# Altium schematic sheet PCM2706_CODEC_MAIN.SchDoc
size A4
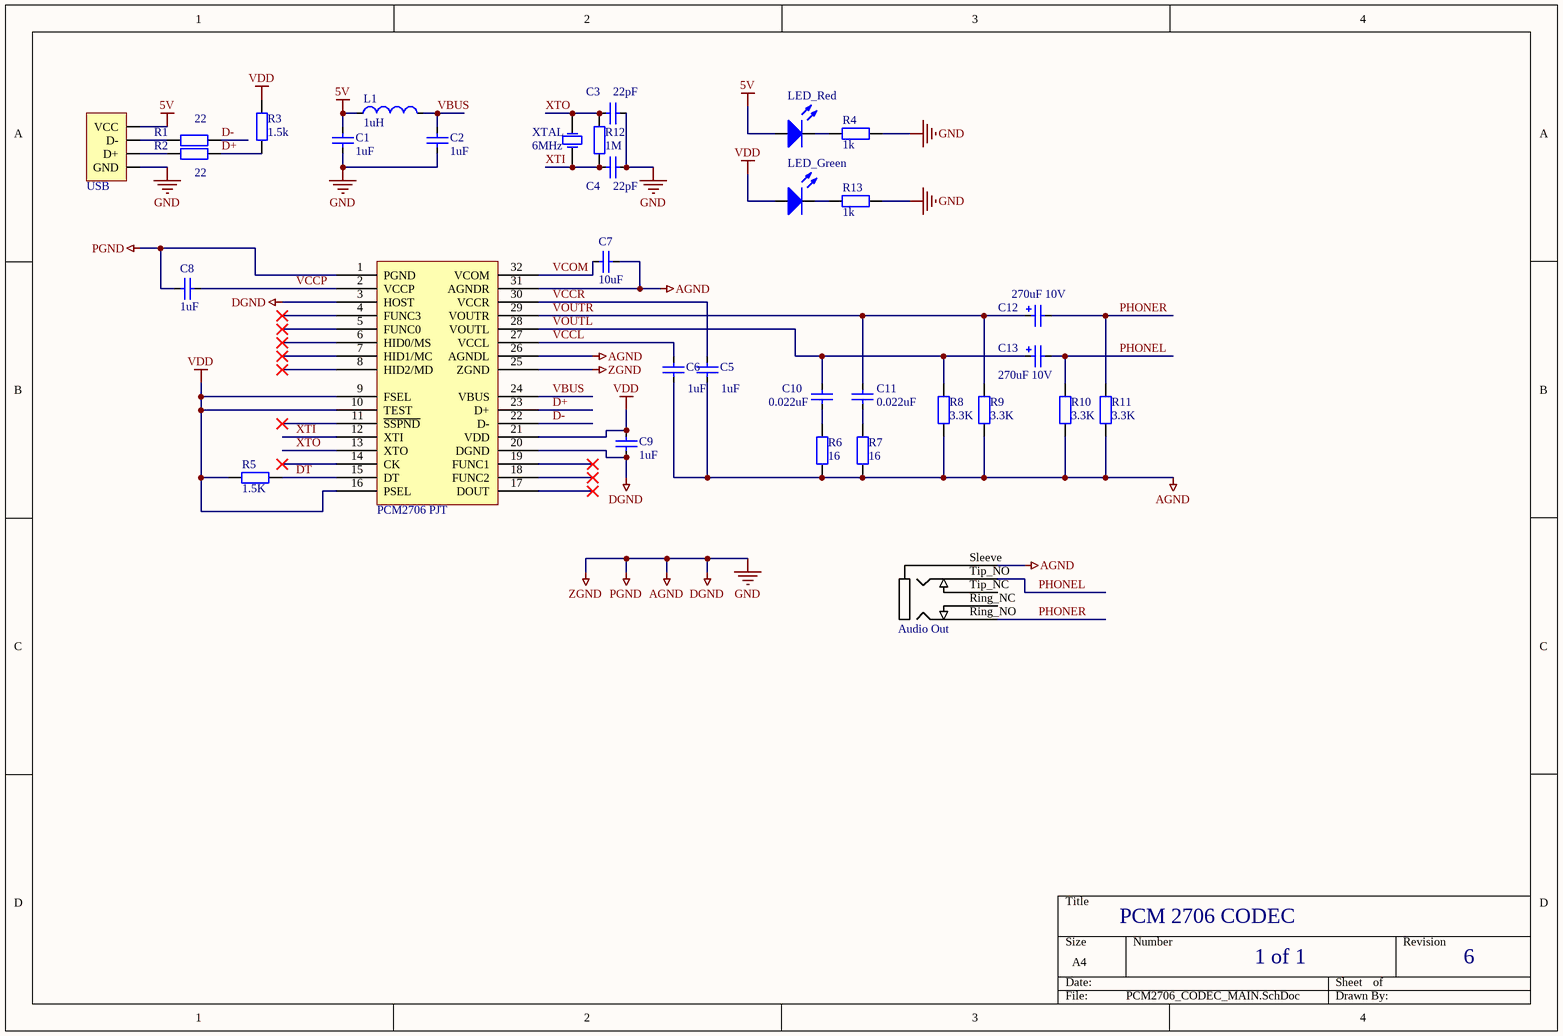
[diagram p0: PCM2706_CODEC_MAIN.SchDoc]

## Parts
Audio_Out  Generic 3.5 PhoneJack 5 Pin through-hole  [3.5 PhoneJack 5 Pin]  (value not drawn)
C1  value 1uF  [CAP_0603]  (hidden comment: Cap_0603)
C2  value 1uF  [CAP_0603]  (hidden comment: Cap_0603)
C3  value 22pF  [CAP_0603]  (hidden comment: Cap_0603)
C4  value 22pF  [CAP_0603]  (hidden comment: Cap_0603)
C5  1uF  [CAP_0603]
C6  1uF  [CAP_0603]
C7  10uF  [CAP_0603]
C8  1uF  [CAP_0603]
C9  1uF  [CAP_0603]
C10  0.022uF  [CAP_0603]
C11  0.022uF  [CAP_0603]
C12  value 270uF 10V  [CAP_ELEC_F3.5_D8_H11.5]  (hidden comment: 270uF)
C13  value 270uF 10V  [CAP_ELEC_F3.5_D8_H11.5]  (hidden comment: 270uF)
L1  value 1uH  [IND_0603]  (hidden comment: Ind_0603)
LED_Green  LED_0603_RED  [LED_0603_RED]  (value not drawn)
LED_Red  LED_0603_RED  [LED_0603_RED]  (value not drawn)
PCM2706_PJT  PCM2706 PJT  [TI-S-PQFP-N32]  (value not drawn)
R1  value 22  [RES_0603]  (hidden comment: Res_0603)
R2  value 22  [RES_0603]  (hidden comment: Res_0603)
R3  value 1.5k  [RES_0603]  (hidden comment: Res_0603)
R4  1k  [RES_0603]
R5  1.5K  [RES_0603]
R6  16  [RES_0603]
R7  16  [RES_0603]
R8  3.3K  [RES_0603]
R9  3.3K  [RES_0603]
R10  3.3K  [RES_0603]
R11  3.3K  [RES_0603]
R12  value 1M  [RES_0603]  (hidden comment: Res_0603)
R13  1k  [RES_0603]
USB  USB  [USB]  (value not drawn)
XTAL  value 6MHz  [XTAL_5032]  (hidden comment: XTAL_5032)

## Nets
5V: C1.2 L1.1 LED_Red.1(A) USB.1(VCC)
AGND: Audio_Out.Sleeve C1.1 C2.1 C3.1 C4.1 C5.1 C6.1 C7.1 C8.2 C9.1 PCM2706_PJT.1(PGND) PCM2706_PJT.3(HOST) PCM2706_PJT.20(DGND) PCM2706_PJT.25(ZGND) PCM2706_PJT.26(AGNDL) PCM2706_PJT.31(AGNDR) R4.2 R6.2 R7.2 R8.2 R9.2 R10.2 R11.2 R13.2 USB.4(GND)  [also labelled DGND, GND, PGND, ZGND]
VDD: C9.2 LED_Green.1(A) PCM2706_PJT.9(FSEL) PCM2706_PJT.10(TEST) PCM2706_PJT.16(PSEL) PCM2706_PJT.21(VDD) R3.1 R5.1
D+: PCM2706_PJT.23(D+) R2.2 R3.2
D-: PCM2706_PJT.22(D-) R1.2
DT: PCM2706_PJT.15(DT) R5.2
PHONEL: Audio_Out.Tip_NO C13.2 R10.1
PHONER: Audio_Out.Ring_NO C12.2 R11.1
VBUS: C2.2 L1.2 PCM2706_PJT.24(VBUS)
VCCL: C6.2 PCM2706_PJT.27(VCCL)
VCCP: C8.1 PCM2706_PJT.2(VCCP)
VCCR: C5.2 PCM2706_PJT.30(VCCR)
VCOM: C7.2 PCM2706_PJT.32(VCOM)
VOUTL: C10.2 C13.1 PCM2706_PJT.28(VOUTL) R8.1
VOUTR: C11.2 C12.1 PCM2706_PJT.29(VOUTR) R9.1
XTI: C4.2 PCM2706_PJT.12(XTI) R12.2 XTAL.1(OSC1)
XTO: C3.2 PCM2706_PJT.13(XTO) R12.1 XTAL.2(OSC2)
NetC10_1: C10.1 R6.1
NetC11_1: C11.1 R7.1
NetLED_Green_2: LED_Green.2(K) R13.1
NetLED_Red_2: LED_Red.2(K) R4.1
NetR1_1: R1.1 USB.2(D-)
NetR2_1: R2.1 USB.3(D+)

Not connected (* = marked no-connect by the designer): Audio_Out Ring_NC Tip_NC; PCM2706_PJT 4(FUNC3)* 5(FUNC0)* 6(HID0/MS)* 7(HID1/MC)* 8(HID2/MD)* 11(~{SSPND})* 14(CK)* 17(DOUT)* 18(FUNC2)* 19(FUNC1)*

## Notes on the sheet
- PCM 2706 CODEC
- 1 of 1
- 6

## Library data of the parts
C1-C4 = Cap_0603: Capacitor
C5-C11 = Cap_0603
  C5 C6 C8 C9: Value: 1uF
  C7: Value: 10uF
  C10 C11: Value: 0.022uF
C12 C13 = Cap_ELEC_8*11.5*3.5
L1 = Ind_0603: Inductor
LED_Green LED_Red = LED_0603_RED: LED
PCM2706_PJT = PCM2706 PJT: PCM2706 USB CODEC; Vender: TI
R1-R3 R5 R12 = Res_0603: Resistor
  R5: Value: 1.5K
R4 R6-R11 R13 = Res_0603
  R4 R13: Value: 1k
  R6 R7: Value: 16
  R8-R11: Value: 3.3K
XTAL = XTAL_5032: Crystal Oscillator; Published: 8-Jun-2000; LatestRevisionDate: 17-Jul-2002; LatestRevisionNote: Re-released for DXP Platform.; PackageReference: R38; Publisher: Altium Limited; PackageDescription: Crystal, Thru-Hole; 2 Leads; Body 3.1 x 8.2 mm (Dia.xH)